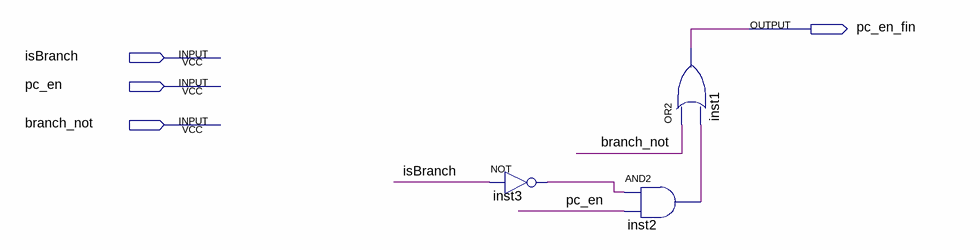
[diagram p0: schematic sheet]
// Quartus schematic pc_en_decode.bdf as structural Verilog: 3 symbols, 4 pins
module pc_en_decode (
  input  isBranch,
  input  pc_en,
  input  branch_not,
  output pc_en_fin
);

  wire inst2_out, inst3_out;

  not inst3 (inst3_out, isBranch);
  or inst1 (pc_en_fin, branch_not, inst2_out);
  and inst2 (inst2_out, inst3_out, pc_en);
endmodule
